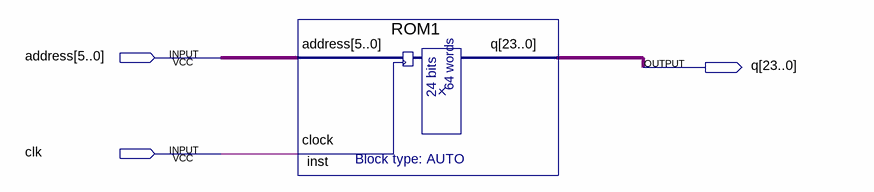
[diagram p0: schematic sheet]
// Quartus schematic exercise_ROM.bdf as structural Verilog: 1 symbols, 3 pins
module exercise_ROM (
  input  [5:0] address,
  input  clk,
  output [23:0] q
);

  ROM1 inst (.address(address), .clock(clk), .q(q));
endmodule
